# EAGLE schematic TapuinoMini (EAGLE 7.6.0)
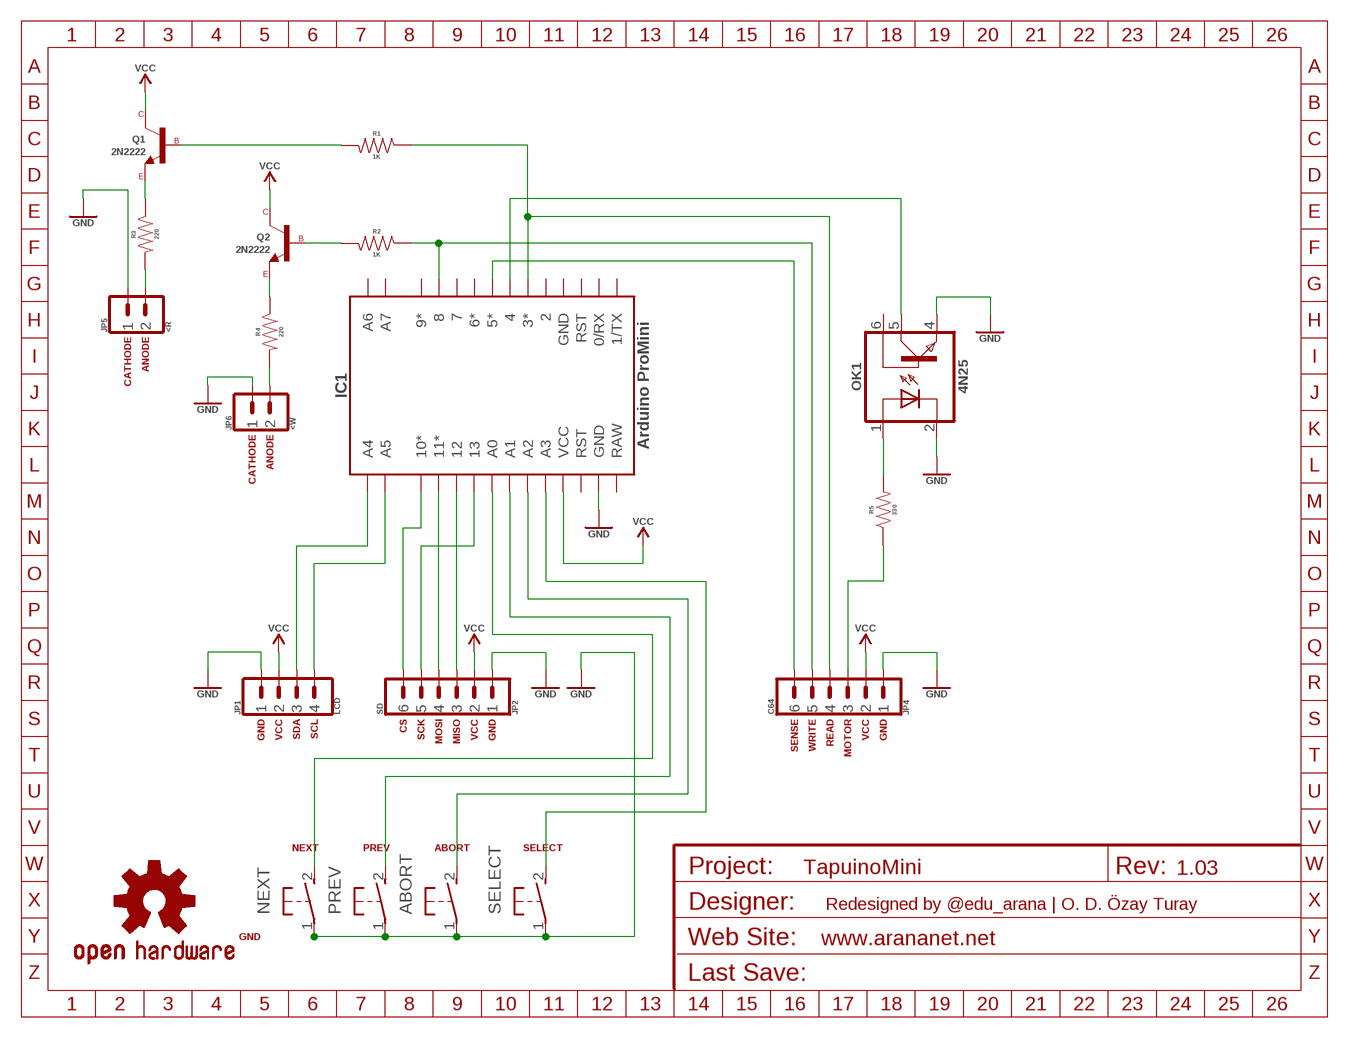
[diagram p0: schematic, sheet 1]

## Parts
ABORT  31-XX  [B3F-31XX]
IC1  Arduino ProMini  PROMINI_A  [PROMINI_A]
JP1  LCD  1X04_SQR  [1X04_SQR]
JP2  SD  1X06_SQR  [1X06_SQR]
JP4  C64  1X06_SQR  [1X06_SQR]
JP5  <R  1X02_SQR  [1X02_SQR]
JP6  <W  1X02_SQR  [1X02_SQR]
LOGO1  OSHW-LOGOL  [OSHW-LOGO-L]
NEXT  31-XX  [B3F-31XX]
OK1  4N25  OPTO_6PIN_4NXX  [DIP06]
PREV  31-XX  [B3F-31XX]
Q1  2N2222  TRANSISTOR_NPN_EBC  [TO-92]
Q2  2N2222  TRANSISTOR_NPN_EBC  [TO-92]
R1  1K  RESISTOR_PTH_0.3  [RESISTOR_PTH_0.3]
R2  1K  RESISTOR_PTH_0.3  [RESISTOR_PTH_0.3]
R3  220  RESISTOR_PTH_0.3  [RESISTOR_PTH_0.3]
R4  220  RESISTOR_PTH_0.3  [RESISTOR_PTH_0.3]
R5  330  RESISTOR_PTH_0.3  [RESISTOR_PTH_0.3]
SELECT  31-XX  [B3F-31XX]

## Nets
CS: IC1.10* JP2.6
MISO: IC1.12 JP2.3
MOSI: IC1.11* JP2.4
MOTOR1: JP4.3 R5.1
MOTOR2: OK1.1(ANODE) R5.2
MOTOR3: IC1.4 OK1.5(COLLECTOR)
N$2: ABORT.2(S) IC1.A2
N$3: ABORT.1(P) IC1.GND@1(GND) JP1.1 JP2.1 JP4.1 JP5.1 JP6.1 NEXT.1(P) OK1.2(CATHODE) OK1.4(EMITTER) PREV.1(P) SELECT.1(P) ; supply symbol labelled GND
N$4: IC1.VCC JP1.2 JP2.2 JP4.2 Q1.3(COLLECTOR) Q2.3(COLLECTOR) ; supply symbol labelled VCC
NEXT: IC1.A0 NEXT.2(S)
PREV: IC1.A1 PREV.2(S)
READ1: IC1.3* JP4.4 R1.1
READ2: Q1.2(BASE) R1.2
READ3: Q1.1(EMITTER) R3.1
READ4: JP5.2 R3.2
SCK: IC1.13 JP2.5
SCL: IC1.A5 JP1.4
SDA: IC1.A4 JP1.3
SELECT: IC1.A3 SELECT.2(S)
SENSE: IC1.5* JP4.6
WRITE1: IC1.8 JP4.5 R2.1
WRITE2: Q2.2(BASE) R2.2
WRITE3: Q2.1(EMITTER) R4.1
WRITE4: JP6.2 R4.2
Unconnected: IC1.0/RX IC1.1/TX IC1.2 IC1.6* IC1.7 IC1.9* IC1.A6 IC1.A7 IC1.GND@2(GND) IC1.RAW IC1.RST@1(RST) IC1.RST@2(RST) OK1.6(BASE)

## Notes on the sheet
- CATHODE | ANODE
- CATHODE | ANODE
- GND | VCC | SDA | SCL | CS | SCK | MOSI | MISO | VCC | GND | SENSE | WRITE | READ | MOTOR | VCC | GND
- NEXT | PREV | ABORT | SELECT
- GND

## Library data of the parts
ABORT NEXT PREV SELECT = switch-omron:31-XX: OMRON SWITCH; MPN: B3F-3100; OC_FARNELL: 959704; OC_NEWARK: 36M3582
IC1 = sj_arduino:PROMINI: Arduino Pro Mini
JP1 = sj_connectors:1X04: 1x04 - 0.1" Pin Header
JP2 JP4 = sj_connectors:1X06: 1x06 - 0.1" Pin Header
JP5 JP6 = sj_connectors:1X02: 1x02 - 0.1" Pin Header
LOGO1 = sj_temp:OSHW-LOGO: Open Source Hardware Logo This logo indicates the piece of hardware it is found on incorporates a OSHW license and/or adheres to the definition of open source hardware found here: http://freedomdefined.org/OSHW
OK1 = sj_standart:OPTO_6PIN: 6-pin OptoCoupler
Q1 Q2 = sj_standart:TRANSISTOR_NPN: Generic NPN Bipolar Junction Transistor
R1-R5 = sj_standart:RESISTOR: Resistor